# Altium schematic sheet proc.SchDoc
size Letter
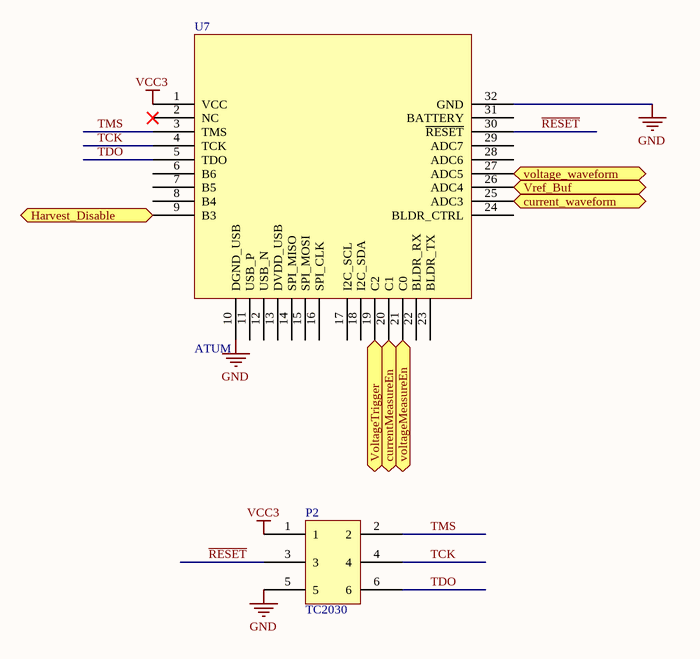
[diagram p0: proc.SchDoc]

## Parts
P2  TC2030  [TC2030-IDC-NLFP]
U7  ATUM  [ATUM]

## Ports
current_waveform, currentMeasureEn, Harvest_Disable, voltage_waveform, voltageMeasureEn, VoltageTrigger, Vref_Buf

## Nets
GND: P2.5 U7.10(DGND_USB) U7.32(GND)
VCC3: P2.1 U7.1(VCC)
current_waveform: U7.25(ADC3) ; port current_waveform
currentMeasureEn: U7.20(C1) ; port currentMeasureEn
Harvest_Disable: U7.9(B3) ; port Harvest_Disable
~{RESET}: P2.3 U7.30(~{RESET})
TCK: P2.4 U7.4(TCK)
TDO: P2.6 U7.5(TDO)
TMS: P2.2 U7.3(TMS)
voltage_waveform: U7.27(ADC5) ; port voltage_waveform
voltageMeasureEn: U7.21(C0) ; port voltageMeasureEn
VoltageTrigger: U7.19(C2) ; port VoltageTrigger
Vref_Buf: U7.26(ADC4) ; port Vref_Buf

Not connected (* = marked no-connect by the designer): U7 2(NC)* 6(B6) 7(B5) 8(B4) 11(USB_P) 12(USB_N) 13(DVDD_USB) 14(SPI_MISO) 15(SPI_MOSI) 16(SPI_CLK) 17(I2C_SCL) 18(I2C_SDA) 22(BLDR_RX) 23(BLDR_TX) 24(BLDR_CTRL) 28(ADC6) 29(ADC7) 31(BATTERY)

## Notes on the sheet
- Title
- Date:
- Author:
- Revision:
- Sheet
- of
- University of Michigan
- File:

## Library data of the parts
P2 = TC2030: TC2030-MCP-NL